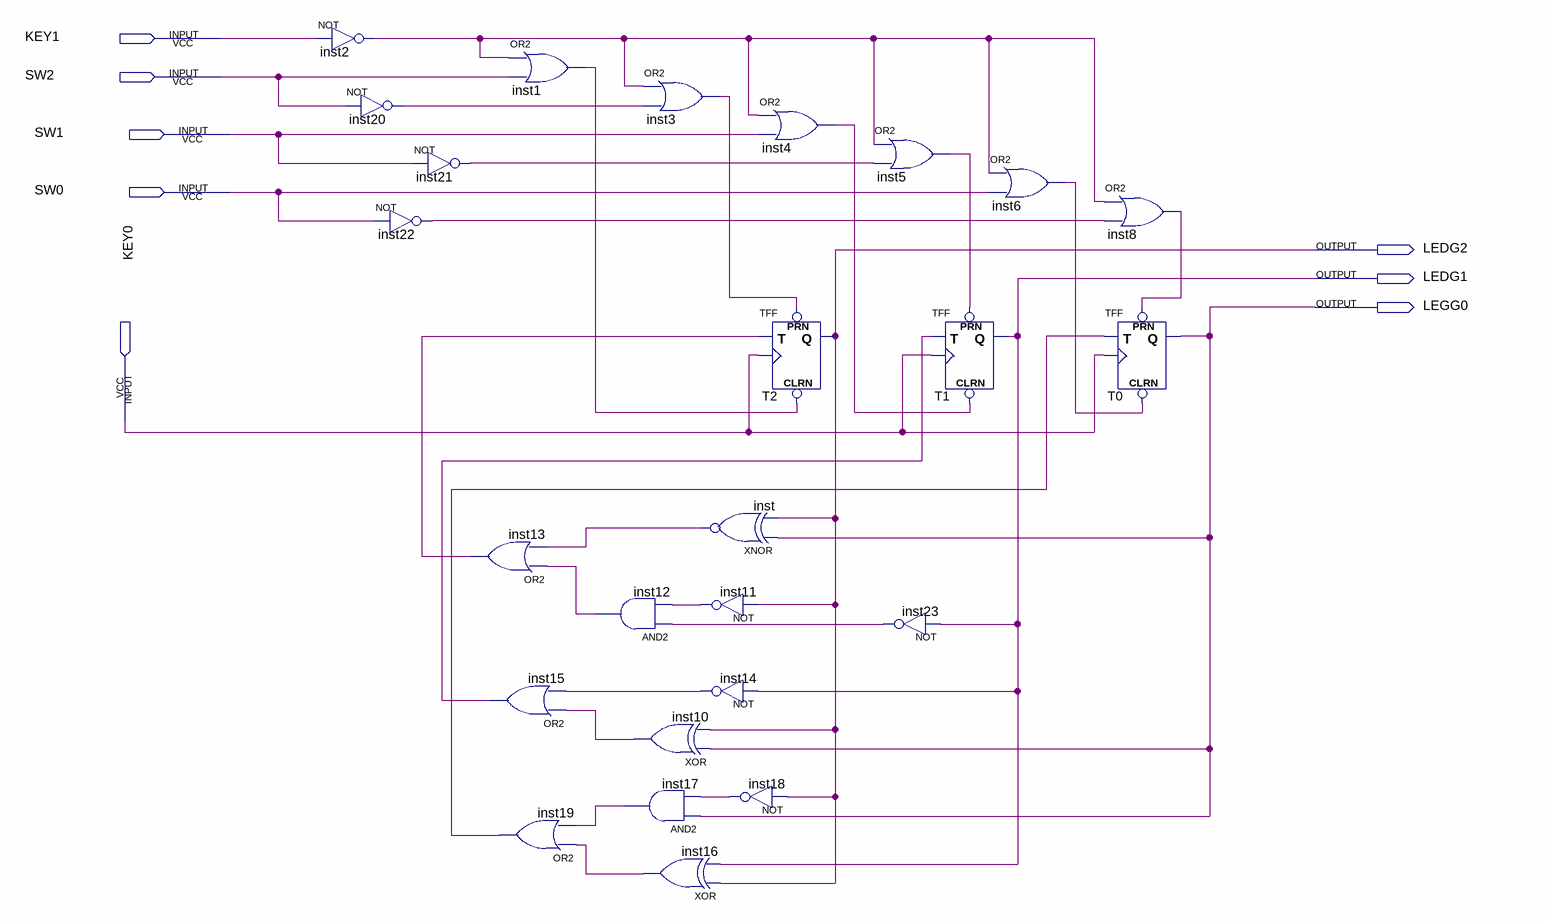
[diagram p0: schematic sheet]
// Quartus schematic Lab01_test_vid.bdf as structural Verilog: 25 symbols, 8 pins
module Lab01_test_vid (
  input  KEY1,
  input  SW2,
  input  SW1,
  input  SW0,
  input  KEY0,
  output LEDG2,
  output LEDG1,
  output LEGG0
);

  wire inst1_out, inst2_out, inst3_out, inst4_out, inst5_out, inst6_out, inst8_out, inst10_out, inst11_out,
       inst12_out, inst13_out, inst14_out, inst15_out, inst16_out, inst17_out, inst18_out, inst19_out,
       inst20_out, inst21_out, inst22_out, inst23_out, inst_out;

  not inst2 (inst2_out, KEY1);
  not inst20 (inst20_out, SW2);
  not inst22 (inst22_out, SW0);
  not inst21 (inst21_out, SW1);
  or inst13 (inst13_out, inst12_out, inst_out);
  or inst1 (inst1_out, inst2_out, SW2);
  or inst15 (inst15_out, inst10_out, inst14_out);
  or inst19 (inst19_out, inst16_out, inst17_out);
  and inst12 (inst12_out, inst23_out, inst11_out);
  and inst17 (inst17_out, LEGG0, inst18_out);
  or inst3 (inst3_out, inst2_out, inst20_out);
  xnor inst (inst_out, LEGG0, LEDG2);
  not inst11 (inst11_out, LEDG2);
  not inst14 (inst14_out, LEDG1);
  xor inst10 (inst10_out, LEGG0, LEDG2);
  xor inst16 (inst16_out, LEDG2, LEDG1);
  or inst4 (inst4_out, inst2_out, SW1);
  TFF T2 (.PRN(inst3_out), .CLRN(inst1_out), .T(inst13_out), .CLK(KEY0), .Q(LEDG2));
  not inst18 (inst18_out, LEDG2);
  or inst5 (inst5_out, inst2_out, inst21_out);
  TFF T1 (.PRN(inst5_out), .CLRN(inst4_out), .T(inst15_out), .CLK(KEY0), .Q(LEDG1));
  not inst23 (inst23_out, LEDG1);
  or inst6 (inst6_out, inst2_out, SW0);
  or inst8 (inst8_out, inst2_out, inst22_out);
  TFF T0 (.PRN(inst8_out), .CLRN(inst6_out), .T(inst19_out), .CLK(KEY0), .Q(LEGG0));
endmodule
